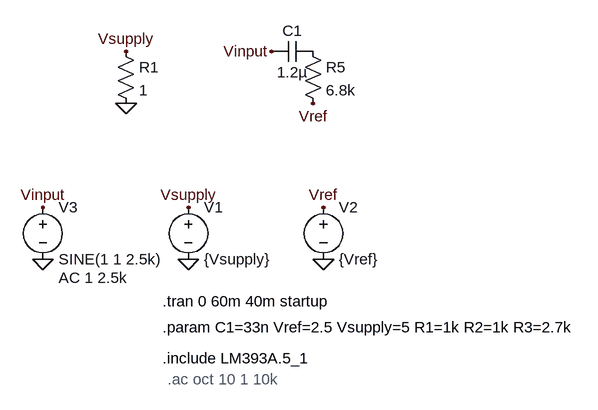
[diagram p0: schematic signal conditioning.asc]
signal conditioning.asc, the LTspice schematic file:
Version 4
SHEET 1 4884 1040
FLAG -288 352 0
FLAG -288 272 Vsupply
FLAG -80 272 Vref
FLAG -80 352 0
FLAG -160 32 Vinput
FLAG -512 352 0
FLAG -512 272 Vinput
FLAG -96 112 Vref
FLAG -384 112 0
FLAG -384 32 Vsupply
SYMBOL voltage -288 256 R0
WINDOW 123 0 0 Left 0
WINDOW 39 0 0 Left 0
SYMATTR InstName V1
SYMATTR Value {Vsupply}
SYMBOL voltage -80 256 R0
WINDOW 123 0 0 Left 0
WINDOW 39 0 0 Left 0
SYMATTR InstName V2
SYMATTR Value {Vref}
SYMBOL voltage -512 256 R0
WINDOW 123 24 124 Left 2
WINDOW 39 0 0 Left 0
SYMATTR Value2 AC 1 2.5k
SYMATTR InstName V3
SYMATTR Value SINE(1 1 2.5k)
SYMBOL cap -96 16 R90
WINDOW 0 0 32 VBottom 2
WINDOW 3 32 32 VTop 2
SYMATTR InstName C1
SYMATTR Value 1.2µ
SYMBOL res -112 16 R0
SYMATTR InstName R5
SYMATTR Value 6.8k
SYMBOL res -400 16 R0
SYMATTR InstName R1
SYMATTR Value 1
TEXT -328 416 Left 2 !.tran 0 60m 40m startup
TEXT -328 456 Left 2 !.param C1=33n Vref=2.5 Vsupply=5 R1=1k R2=1k R3=2.7k
TEXT -328 504 Left 2 !.include LM393A.5_1
TEXT -320 536 Left 2 ;.ac oct 10 1 10k

The netlist it stands for:
* signal conditioning.asc
V1 Vsupply 0 {Vsupply}
V2 Vref 0 {Vref}
V3 Vinput 0 SINE(1 1 2.5k) AC 1 2.5k
C1 P001 Vinput 1.2µ
R5 P001 Vref 6.8k
R1 Vsupply 0 1
.tran 0 60m 40m startup
.param C1=33n Vref=2.5 Vsupply=5 R1=1k R2=1k R3=2.7k
.include LM393A.5_1
* .ac oct 10 1 10k
.backanno
.end